# EAGLE design Status board - mode switch C (EAGLE 7.1.0)
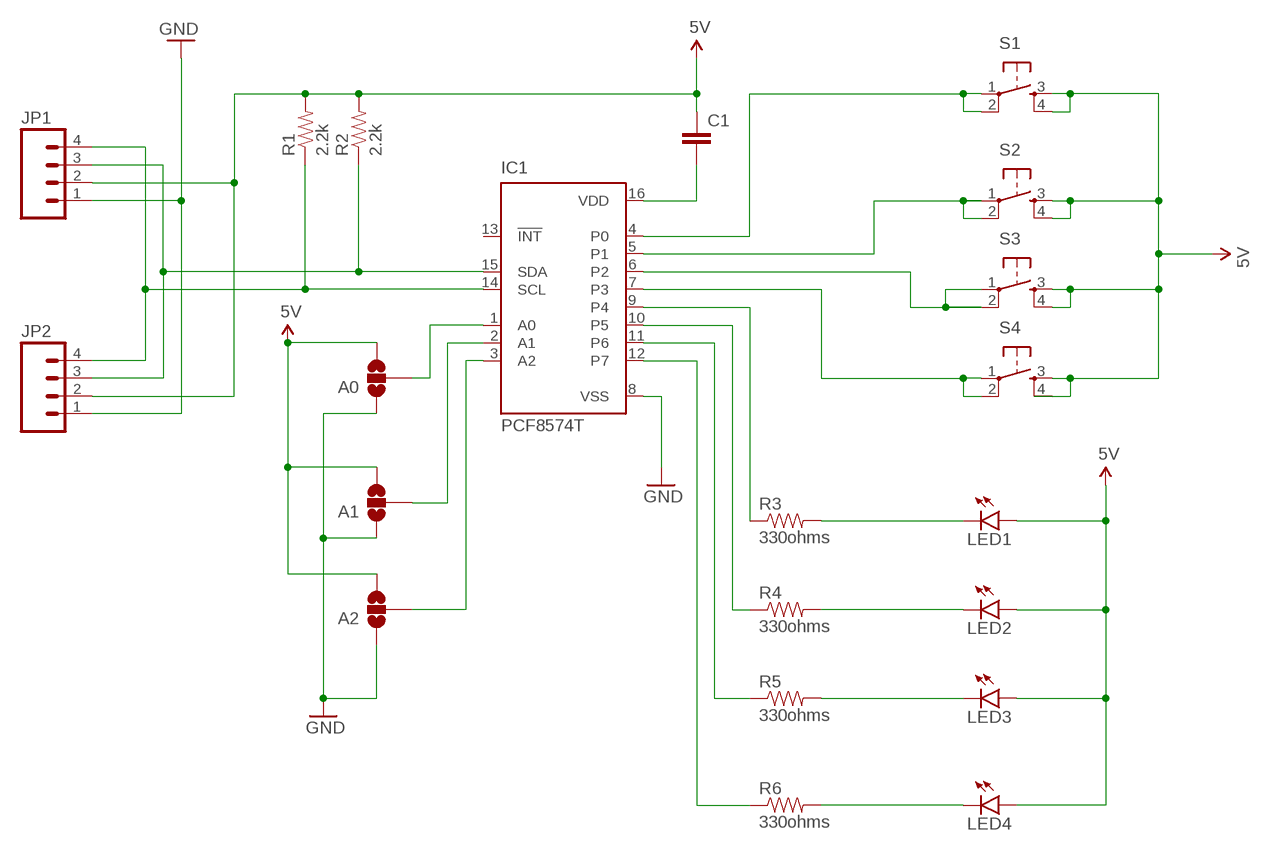
[diagram p0: schematic, sheet 1]

## Parts
A0  SOLDERJUMPER_2WAYS  [SJ_3]
A1  SOLDERJUMPER_2WAYS  [SJ_3]
A2  SOLDERJUMPER_2WAYS  [SJ_3]
C1  CAPPTH2  [CAP-PTH-SMALL2]
IC1  PCF8574T  [SO16W]
JP1  M04PTH  [1X04]
JP2  M04PTH  [1X04]
LED1  LED3MM  [LED3MM]
LED2  LED3MM  [LED3MM]
LED3  LED3MM  [LED3MM]
LED4  LED3MM  [LED3MM]
R1  2.2k  RESISTORAXIAL-0.3  [AXIAL-0.3]
R2  2.2k  RESISTORAXIAL-0.3  [AXIAL-0.3]
R3  330ohms  RESISTORAXIAL-0.3  [AXIAL-0.3]
R4  330ohms  RESISTORAXIAL-0.3  [AXIAL-0.3]
R5  330ohms  RESISTORAXIAL-0.3  [AXIAL-0.3]
R6  330ohms  RESISTORAXIAL-0.3  [AXIAL-0.3]
S1  TAC_SWITCHPTH  [TACTILE-PTH]
S2  TAC_SWITCHPTH  [TACTILE-PTH]
S3  TAC_SWITCHPTH  [TACTILE-PTH]
S4  TAC_SWITCHPTH  [TACTILE-PTH]

## Nets
5V: A0.3 A1.3 A2.3 C1.1 JP1.2 JP2.2 LED1.A LED2.A LED3.A LED4.A R1.P$2 R2.P$2 S1.3 S1.4 S2.3 S2.4 S3.3 S3.4 S4.3 S4.4
GND: A0.1 A1.1 A2.1 IC1.8(VSS) JP1.1 JP2.1
N$1: IC1.5(P1) S2.1 S2.2
N$2: IC1.7(P3) S4.1 S4.2
N$3: IC1.6(P2) S3.1 S3.2
N$4: A1.2 IC1.2(A1)
N$5: IC1.14(SCL) JP1.4 JP2.4 R1.P$1
N$6: IC1.15(SDA) JP1.3 JP2.3 R2.P$1
N$7: A0.2 IC1.1(A0)
N$8: C1.2 IC1.16(VDD)
N$9: A2.2 IC1.3(A2)
N$10: LED4.K(C) R6.P$2
N$11: IC1.9(P4) R3.P$1
N$12: IC1.10(P5) R4.P$1
N$13: IC1.11(P6) R5.P$1
N$14: IC1.12(P7) R6.P$1
N$15: LED3.K(C) R5.P$2
N$16: LED2.K(C) R4.P$2
N$17: LED1.K(C) R3.P$2
N$35: IC1.4(P0) S1.1 S1.2
Unconnected: IC1.13(!INT)

## Library data of the parts
A0 A1 A2 = SparkFun-Retired:SOLDERJUMPER_2WAY: Solder Jumper 2 way solder jumper
C1 = SparkFun-Capacitors:CAP: Capacitor Standard 0603 ceramic capacitor, and 0.1" leaded capacitor.
IC1 = micro-philips:PCF8574: I2C-Bus Remote 8-bit I/O expander http://www.semiconductors.philips.com/acrobat_download/datasheets/PCF8574_4.pdf
JP1 JP2 = SparkFun-Connectors:M04: Header 4 Standard 4-pin 0.1" header. Use with straight break away headers (SKU : PRT-00116), right angle break away headers (PRT-00553), swiss pins (PRT-00743), machine pins (PRT-00117), and female headers (PRT-00115). Molex polarized connector foot print use with SKU : PRT-08231 with associated crimp pins and housings. 1MM SMD Version SKU: PRT-10208
LED1-LED4 = SparkFun-LED:LED: LEDs Standard schematic elements and footprints for 5mm, 3mm, 1206, and 0603 sized LEDs. 5mm - Spark Fun Electronics SKU : COM-00529 (and others)
R1-R6 = SparkFun-Resistors:RESISTOR: Resistor Basic schematic elements and footprints for 0603, 1206, and PTH resistors.
S1-S4 = SparkFun-Electromechanical:TAC_SWITCH: Momentary Switch Button commonly used for reset or general input. Spark Fun Electronics SKU : COM-00097 SMT- SWCH-08247

## Board
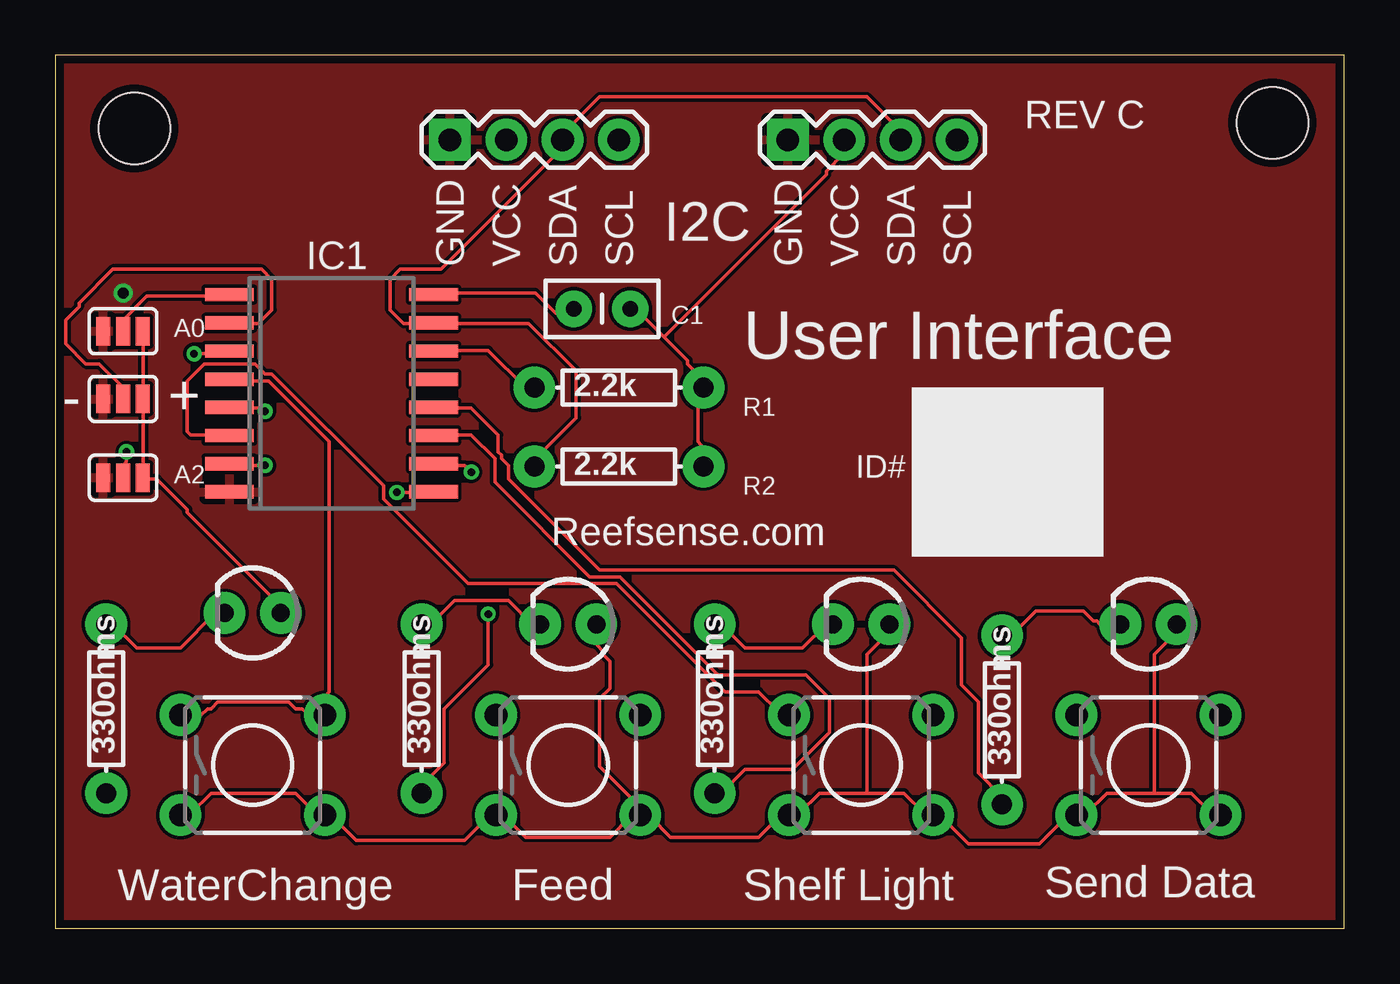
[diagram p1: board, top side]
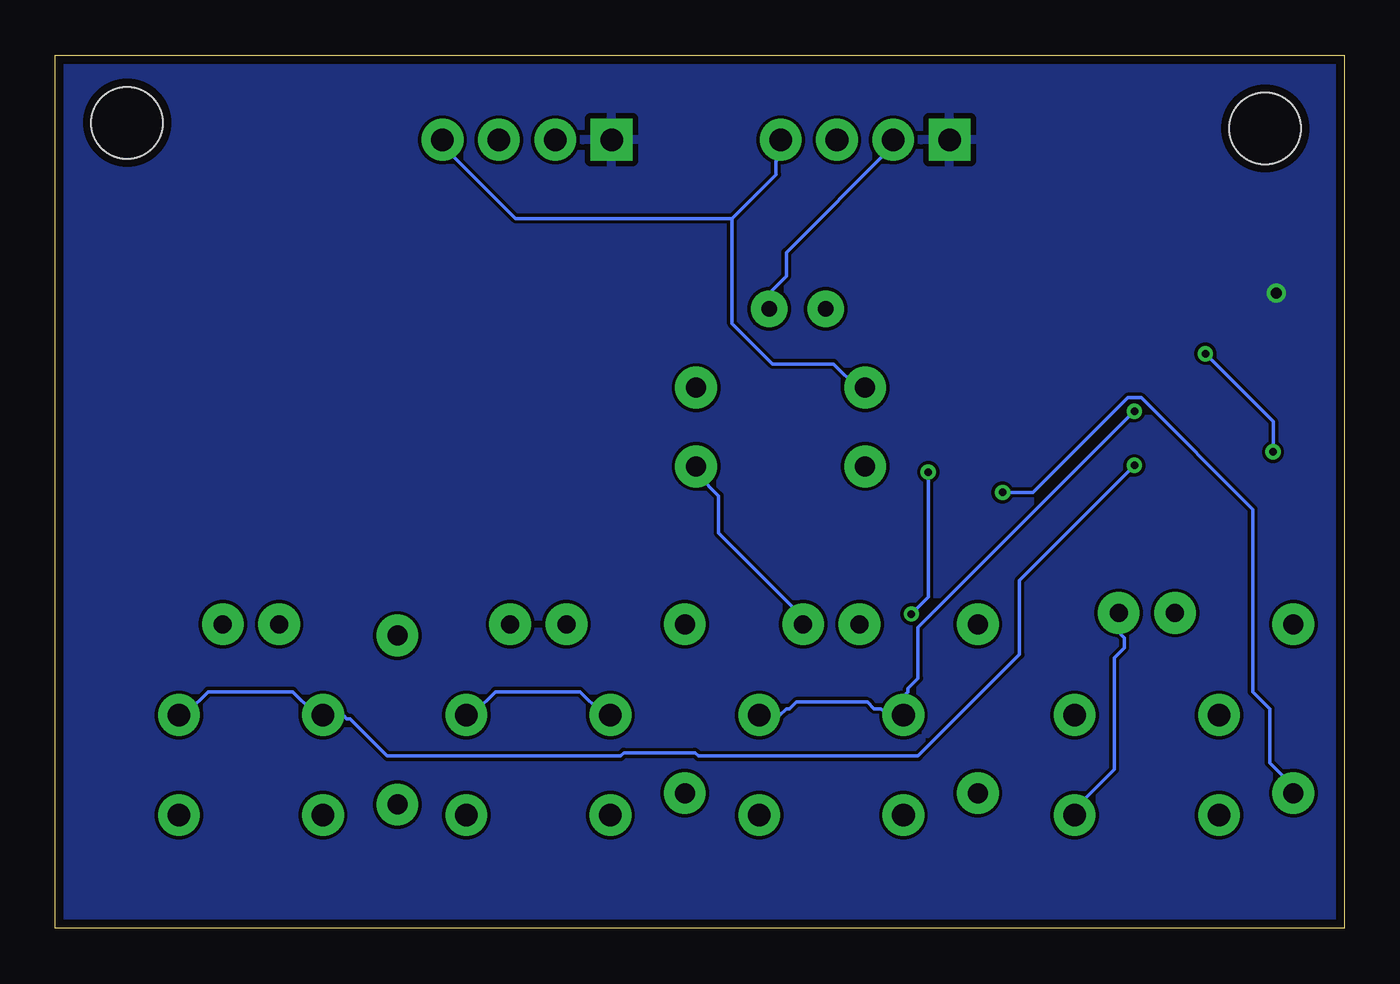
[diagram p2: board, bottom side, seen from below]

Size 58.09 x 39.36 mm. Coordinates in mm from the lower left corner, seen from the top.
Outline: 0,0 58.09,0 58.09,39.36 0,39.36 0,0
Copper layers (1*16): Top 0.0356mm / dielectric 1.5011mm / Bottom 0.0356mm
Design rules "LaenPCBOrder": minimum track width 6mil, minimum drill 13mil, track to track 6mil, track to pad 6mil, pad to pad 6mil, via to via 6mil, smd to smd 6mil, copper to edge 15mil, drill to drill 6mil, minimum pad ring 7mil, minimum via ring 7mil, stop-mask expansion 3mil, vias tented up to drill 0mil, thermal gap 10mil
Holes 3.2 mm at 3.56,36.07 54.86,36.32

### Footprints (pad centres in the part's own frame; a part is rotated, then mirrored left to right if it is on the bottom)
SJ_3 = smd 0.635 x 1.27: 1 -0.889,0; 2 0,0; 3 0.889,0
CAP-PTH-SMALL2 = drill 0.7 pad 1.651: 1 0,0; 2 2.54,0
SO16W = smd 0.6 x 2.2: 1 -4.445,-4.6; 2 -3.175,-4.6; 3 -1.905,-4.6; 4 -0.635,-4.6; 5 0.635,-4.6; 6 1.905,-4.6; 7 3.175,-4.6; 8 4.445,-4.6; 9 4.445,4.6; 10 3.175,4.6; 11 1.905,4.6; 12 0.635,4.6; 13 -0.635,4.6; 14 -1.905,4.6; 15 -3.175,4.6; 16 -4.445,4.6
1X04 = drill 1.016 pad 1.88 square: 1 0,0 | drill 1.016 pad 1.88: 2 2.54,0; 3 5.08,0; 4 7.62,0
LED3MM = drill 0.813 pad 1.88: A -1.27,0; K 1.27,0
AXIAL-0.3 = drill 0.9 pad 1.88: P$1 -3.81,0; P$2 3.81,0
TACTILE-PTH = drill 1.016 pad 1.88: 1 -3.251,2.261; 2 3.251,2.261; 3 -3.251,-2.261; 4 3.251,-2.261

### Placement (x,y rotation side)
A0  3.05,26.92 0 top
A1  3.05,23.88 0 top
A2  3.05,20.32 0 top
C1  25.91,27.94 180 top
IC1  12.45,24.13 270 top
JP1  17.78,35.56 0 top
JP2  33.02,35.56 0 top
LED1  8.89,14.22 180 top
LED2  23.11,13.72 180 top
LED3  36.32,13.72 180 top
LED4  49.28,13.72 180 top
R1  25.4,24.38 0 top
R2  25.4,20.83 0 top
R3  2.29,9.91 90 top
R4  16.51,9.91 90 top
R5  29.72,9.91 90 top
R6  42.67,9.4 90 top
S1  8.89,7.37 0 top
S2  23.11,7.37 0 top
S3  36.32,7.37 0 top
S4  49.28,7.37 0 top

### Tracks (layer width: path | path; a pad name or v marks a point on that pad's centre or on a via)
5V
  Top 0.152: 27.43,26.67 28.5,25.6 28.5,25.45 29.11,24.84 29.11,24.38 | 27.43,26.67 26.21,27.89 25.91,27.89 C1.1 | 27.43,26.67 34.75,33.98 34.75,34.14 35.51,34.9 35.51,35.51 JP2.2 | 29.11,24.38 28.96,24.23 28.96,21.95 29.11,21.79 29.11,20.88 R2.P$2 | 29.11,24.38 R1.P$2 | 36.58,6.1 38.25,6.1 39.17,5.18 39.47,5.18 S3.4 39.62,5.03 39.93,5.03 41.15,3.81 44.35,3.81 45.57,5.03 46.02,5.03 S4.3 46.02,5.18 46.48,5.18 47.4,6.1 49.53,6.1 | 36.58,6.1 34.44,6.1 33.53,5.18 33.07,5.18 S3.3 33.07,5.03 32.61,5.03 31.7,4.12 27.74,4.12 26.82,5.03 26.36,5.03 | 36.58,6.1 36.58,12.34 37.49,13.26 37.49,13.72 LED3.A | 49.53,6.1 51.21,6.1 52.12,5.18 52.43,5.18 S4.4 | 49.53,6.1 49.53,12.34 50.44,13.26 50.44,13.72 LED4.A | A0.3 3.96,26.82 3.96,23.93 A1.3 3.96,23.77 3.96,20.42 A2.3 3.96,20.27 4.57,20.27 5.94,18.9 5.94,18.75 10.06,14.63 10.06,14.33 LED1.A | S1.3 5.64,5.18 6.1,5.18 7.01,6.1 10.82,6.1 11.73,5.18 12.04,5.18 S1.4 12.19,5.03 12.5,5.03 13.56,3.96 18.44,3.96 19.51,5.03 19.81,5.03 S2.3 19.96,5.03 20.27,5.03 21.18,4.12 24.99,4.12 25.91,5.03 | 26.36,5.03 25.91,5.03 | 26.36,5.03 S2.4 25.91,5.03 | LED2.A 24.38,12.8 24.69,12.5 24.69,12.34 24.99,12.04 24.99,10.82 24.54,10.36 24.54,7.32 25.91,5.94 25.91,5.03
  Bottom 0.152: LED2.A 24.38,14.02 28.19,17.83 28.19,19.51 29.11,20.42 29.11,20.73 R2.P$2 | C1.1 25.91,28.65 25.15,29.41 25.15,30.48 20.42,35.2 20.42,35.51 JP1.2 | LED1.A 10.06,14.17 10.06,13.26 9.91,13.11 9.91,12.65 10.36,12.19 10.36,7.16 12.04,5.49 12.04,5.18 S1.4
GND  (via drill 0.5)
  other vias: 3.05,28.65
  pour Top: -1.02,40.13 76.71,40.13 76.71,-1.02 -1.02,-1.02
  pour Bottom: -1.02,-1.02 76.71,-1.02 76.71,40.13 -1.02,40.13
N$1  (via drill 0.33)
  Top 0.152: v9.45,23.32 9.3,23.47 7.92,23.47 IC1.5
  Bottom 0.152: v9.45,23.32 19.2,13.56 19.2,11.28 19.66,10.82 19.66,10.67 19.81,10.52 19.81,9.75 S2.1 19.96,9.75 20.73,9.75 20.88,9.91 21.18,9.91 21.49,10.21 24.69,10.21 24.99,9.91 25.15,9.91 25.45,9.6 26.36,9.6 S2.2
N$2  (via drill 0.33)
  Top 0.152: v9.45,20.88 7.92,20.88 IC1.7
  Bottom 0.152: v9.45,20.88 14.63,15.7 14.63,12.34 19.2,7.77 29.11,7.77 29.26,7.92 32.46,7.92 32.61,7.77 43.13,7.77 44.81,9.45 44.96,9.45 45.11,9.6 46.02,9.6 S4.1 46.02,9.75 46.48,9.75 47.4,10.67 51.21,10.67 52.12,9.75 52.43,9.75 S4.2
N$3
  Top 0.152: IC1.6 7.77,22.25 6.1,22.25 5.94,22.4 5.94,24.69 6.71,25.45 8.99,25.45 9.45,24.99 9.75,24.99 14.78,19.96 14.78,19.36 18.59,15.54 25.3,15.54 30.18,10.67 31.7,10.67 32.61,9.75 33.07,9.75 S3.1
  Bottom 0.152: S3.2 39.47,9.75 39.17,9.75 38.25,10.67 34.44,10.67 33.53,9.75 33.07,9.75 S3.1
N$4
  Top 0.152: A1.2 3.05,24.38 1.98,25.45 1.37,25.45 0.46,26.36 0.46,27.43 1.07,28.04 1.07,28.19 2.59,29.72 9.3,29.72 9.75,29.26 9.75,27.89 9.14,27.28 7.92,27.28 IC1.2
N$5
  Top 0.152: R1.P$1 21.18,24.38 19.51,26.06 17.07,26.06 IC1.14
  Bottom 0.152: 27.58,32 25.6,33.98 25.6,34.59 25.45,34.75 25.45,35.51 JP1.4 | 27.58,32 27.58,27.28 25.76,25.45 23.01,25.45 21.95,24.38 R1.P$1 | 27.58,32 37.34,32 40.54,35.2 40.54,35.51 JP2.4
N$6
  Top 0.152: R2.P$1 21.64,20.88 21.64,21.18 23.47,23.01 23.47,25.15 21.34,27.28 17.07,27.28 IC1.15 16.92,27.28 15.7,27.28 15.09,27.89 15.09,29.26 15.54,29.72 17.37,29.72 22.86,35.2 JP1.3 22.86,35.81 24.54,37.49 36.58,37.49 38.1,35.97 JP2.3
N$7
  Top 0.152: A0.2 3.05,27.43 4.12,28.5 7.77,28.5 IC1.1
N$8
  Top 0.152: C1.2 23.16,27.74 22.55,27.74 21.64,28.65 17.07,28.65 IC1.16
N$9  (via drill 0.33)
  Top 0.152: A2.2 3.05,20.88 3.2,21.03 v3.2,21.49 | v6.25,25.91 7.77,25.91 IC1.3
  Bottom 0.152: v3.2,21.49 3.2,22.86 v6.25,25.91
N$10
  Top 0.152: LED4.K 47.09,13.72 46.94,13.87 46.79,13.87 46.33,14.33 44.2,14.33 43.13,13.26 42.67,13.26 R6.P$2
N$11  (via drill 0.33)
  Top 0.152: v15.39,19.66 16.92,19.66 IC1.9
  Bottom 0.152: v15.39,19.66 14.02,19.66 9.75,23.93 9.14,23.93 4.12,18.9 4.12,10.67 3.35,9.91 3.35,7.47 2.29,6.4 R3.P$1
N$12  (via drill 0.33)
  Top 0.152: v18.75,20.57 18.44,20.88 17.07,20.88 IC1.10 | v19.51,14.17 19.51,11.89 17.53,9.91 17.53,7.47 16.61,6.55 16.61,6.1 R4.P$1
  Bottom 0.152: v18.75,20.57 18.75,14.94 v19.51,14.17
N$13
  Top 0.152: R5.P$1 30.02,6.1 31.09,7.16 33.22,7.16 34.9,8.84 34.9,10.36 33.83,11.43 29.87,11.43 25.45,15.85 24.08,15.85 19.81,20.12 19.81,21.18 18.75,22.25 17.07,22.25 IC1.11
N$14
  Top 0.152: R6.P$1 42.67,5.94 41.6,7.01 41.6,10.21 40.84,10.97 40.84,13.11 37.8,16.15 24.54,16.15 20.42,20.27 20.42,20.88 20.12,21.18 20.12,21.34 19.96,21.49 19.96,22.25 18.75,23.47 17.07,23.47 IC1.12
N$15
  Top 0.152: R5.P$2 30.02,13.72 31.09,12.65 33.68,12.65 34.75,13.72 LED3.K
N$16
  Top 0.152: R4.P$2 16.92,13.72 17.98,14.78 20.42,14.78 21.49,13.72 LED2.K
N$17
  Top 0.152: R3.P$2 2.59,13.72 3.66,12.65 5.64,12.65 7.16,14.17 7.62,14.17 LED1.K
N$35
  Top 0.152: IC1.4 7.92,24.69 9.6,24.69 12.34,21.95 12.34,10.67 12.19,10.52 12.19,9.75 S1.2 12.04,9.75 11.28,9.75 11.12,9.91 10.82,9.91 10.52,10.21 7.32,10.21 7.01,9.91 6.86,9.91 6.55,9.6 5.64,9.6 S1.1

### Text on the board
tNames: REV C | I2C | GND | VCC | SDA | SCL | GND | VCC | SDA | SCL | User Interface | - | + | ID# | Reefsense.com | WaterChange | Feed | Shelf Light | Send Data